# Altium schematic sheet ledcurrentdriver.SchDoc
size A4; DocumentNumber: 1; SheetNumber: 1; SheetTotal: 6
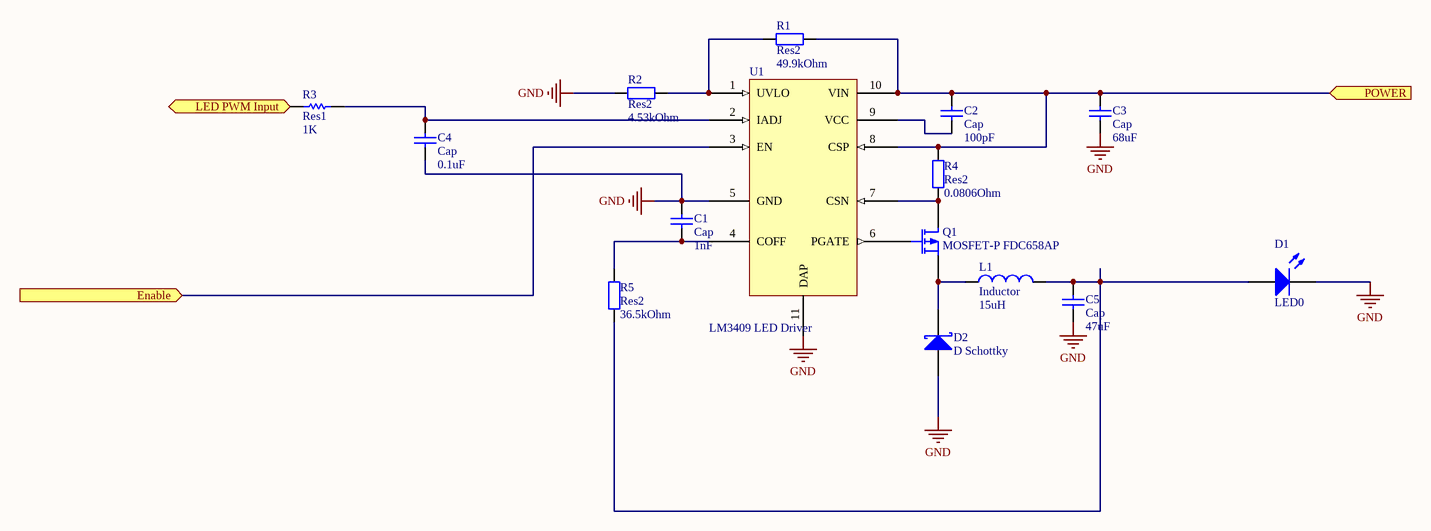
[diagram p0: ledcurrentdriver.SchDoc]

## Parts
C1  Cap  value 1nF  [RAD-0.3]
C2  Cap  value 100pF  [RAD-0.3]
C3  Cap  value 68uF  [RAD-0.3]
C4  Cap  value 0.1uF  [RAD-0.3]
C5  Cap  value 47uF  [RAD-0.3]
D1  LED0  [SML-01 (ROHM LED SERIES)]
D2  D Schottky  [SMB]
L1  Inductor  value 15uH  [0402-A]
Q1  MOSFET-P FDC658AP  [E3]
R1  Res2  value 49.9kOhm  [AXIAL-0.4]
R2  Res2  value 4.53kOhm  [AXIAL-0.4]
R3  Res1  value 1K  [AXIAL-0.3]
R4  Res2  value 0.0806Ohm  [AXIAL-0.4]
R5  Res2  value 36.5kOhm  [AXIAL-0.4]
U1  LM3409 LED Driver  [10eMSOP + thermal pad - LM3409]

## Ports
Enable (in), LED PWM Input (in), POWER (in)

## Nets
GND: C1.2 C3.1 C4.2 C5.1 D1.2(K) D2.1(A) R2.1 U1.5(GND) U1.11(DAP)
Enable: U1.3(EN) ; port Enable
LED PWM Input: R3.1 ; port LED PWM Input
POWER: C2.2 C3.2 R1.2 R4.2 U1.8(CSP) U1.10(VIN) ; port POWER
NetC1_1: C1.1 R5.2 U1.4(COFF)
NetC2_1: C2.1 U1.9(VCC)
NetC4_1: C4.1 R3.2 U1.2(IADJ)
NetC5_2: C5.2 D1.1(A) L1.2 R5.1
NetD2_2: D2.2(K) L1.1 Q1.3(S)
NetQ1_1: Q1.1(D) R4.1 U1.7(CSN)
NetR1_1: R1.1 R2.2 U1.1(UVLO)

Not connected (* = marked no-connect by the designer): Q1 2(G); U1 6(PGATE)

## Notes on the sheet
- Labels drawn without touching a wire or pin: NetLabel1

## Library data of the parts
C1-C5 = Cap: Capacitor; Published: 8-Jun-2000; LatestRevisionDate: 17-Jul-2002; LatestRevisionNote: Re-released for DXP Platform.; PackageReference: RAD-0.3; Publisher: Altium Limited; PackageDescription: Radial Cap, Thru-Hole; 2 Leads; 0.3 in Pin Spacing
D1 = LED0: Typical INFRARED GaAs LED; Published: 8-Jun-2000; LatestRevisionDate: 08-Jul-2005; LatestRevisionNote: Mech Layer 1 removed.; PackageReference: LED-0; Publisher: Altium Limited; PackageDescription: LED; 2 Leads
D2 = D Schottky: Schottky Diode; Published: 8-Jun-2000; LatestRevisionDate: 17-Jul-2002; LatestRevisionNote: Re-released for DXP Platform.; PackageReference: SMB; Publisher: Altium Limited; PackageDescription: DO-214-AA/SMB; 2 C-Bend Leads; Body 5.3 x 3.6 mm, inc. leads (LxW); Code_JEDEC: DO-214-AA
L1 = Inductor: Code_IEC: 1005; Published: 8-Jun-2000; LatestRevisionDate: 29-May-2009; LatestRevisionNote: IPC-7351 Footprint Added.; PackageReference: 0402-A; Publisher: Altium Limited; PackageDescription: Chip Inductor; Code_JEITA: 0402
Q1 = MOSFET-P: P-Channel MOSFET; Published: 8-Jun-2000; LatestRevisionDate: 17-Jul-2002; LatestRevisionNote: Re-released for DXP Platform.; PackageVersion: 1995/1996; PackageReference: E3; Publisher: Altium Limited; PackageDescription: TO, Flat Index; 3 In-Line, Axial Leads; Body Dia. 4.6mm; Lead Dia. 0.5 mm (max)
R1 R2 R4 R5 = Res2: Resistor; Published: 8-Jun-2000; LatestRevisionDate: 17-Jul-2002; LatestRevisionNote: Re-released for DXP Platform.; PackageReference: AXIAL-0.4; Publisher: Altium Limited; PackageDescription: Axial Device, Thru-Hole; 2 Leads; 0.4 in Pin Spacing
R3 = Res1: Resistor; Published: 8-Jun-2000; LatestRevisionDate: 17-Jul-2002; LatestRevisionNote: Re-released for DXP Platform.; PackageReference: AXIAL-0.3; Publisher: Altium Limited; PackageDescription: Axial Device, Thru-Hole; 2 Leads; 0.3 in Pin Spacing
U1 = LM3409: PFET Buck Controller for High Power LED Drivers; Farnell: 1778582 £2.77